# Altium schematic sheet tb-batt-6s.SchDoc
size A
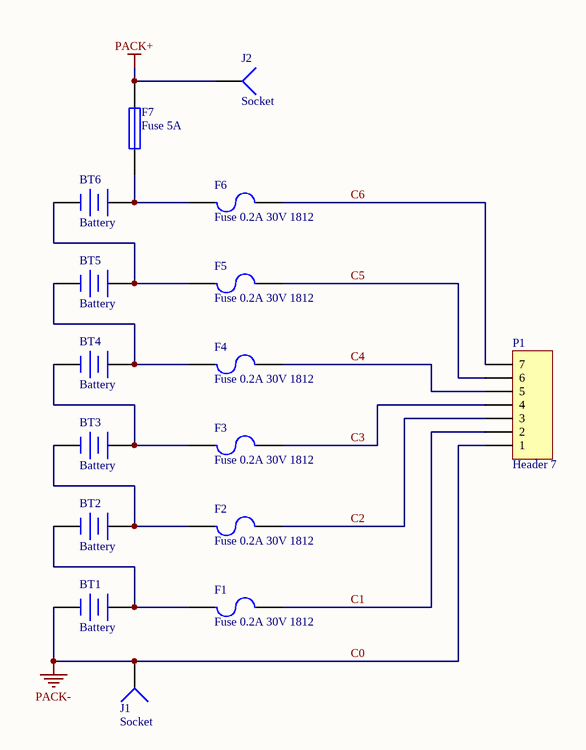
[diagram p0: tb-batt-6s.SchDoc]

## Parts
BT1  Battery  [BAT-2]
BT2  Battery  [BAT-2]
BT3  Battery  [BAT-2]
BT4  Battery  [BAT-2]
BT5  Battery  [BAT-2]
BT6  Battery  [BAT-2]
F1  Fuse 0.2A 30V 1812  [1812]
F2  Fuse 0.2A 30V 1812  [1812]
F3  Fuse 0.2A 30V 1812  [1812]
F4  Fuse 0.2A 30V 1812  [1812]
F5  Fuse 0.2A 30V 1812  [1812]
F6  Fuse 0.2A 30V 1812  [1812]
F7  Fuse 5A  [PIN-W2/E2.8]
J1  Socket  [P+]
J2  Socket  [P+]
P1  Header 7  [HDR1X7]

## Nets
C0: BT1.2(-) J1.1 P1.1  [also labelled PACK-]
PACK+: F7.2 J2.1
C1: F1.2 P1.2
C2: F2.2 P1.3
C3: F3.2 P1.4
C4: F4.2 P1.5
C5: F5.2 P1.6
C6: F6.2 P1.7
NetBT1_1: BT1.1(+) BT2.2(-) F1.1
NetBT2_1: BT2.1(+) BT3.2(-) F2.1
NetBT3_1: BT3.1(+) BT4.2(-) F3.1
NetBT4_1: BT4.1(+) BT5.2(-) F4.1
NetBT5_1: BT5.1(+) BT6.2(-) F5.1
NetBT6_1: BT6.1(+) F6.1 F7.1

## Library data of the parts
BT1-BT6 = Battery: Multicell Battery; Published: 24-Mar-1999; LatestRevisionDate: 17-Jul-2002; LatestRevisionNote: Re-released for DXP Platform.; PackageReference: BAT-2; Publisher: Altium Limited; PackageDescription: Battery; 2 Leads
F1-F6 = Fuse 2: Fuse; Published: 8-Jun-2000; LatestRevisionDate: 17-Jul-2002; LatestRevisionNote: Re-released for DXP Platform.; PackageReference: PIN-W2/E2.8; Publisher: Altium Limited; PackageDescription: Thru-Hole; 2 Leads
F7 = Fuse 1: Fuse; Published: 8-Jun-2000; LatestRevisionDate: 17-Jul-2002; LatestRevisionNote: Re-released for DXP Platform.; PackageReference: PIN-W2/E2.8; Publisher: Altium Limited; PackageDescription: Thru-Hole; 2 Leads
P1 = Header 7: Header, 7-Pin; LatestRevisionDate: 17-Jul-2002; LatestRevisionNote: Re-released for DXP Platform.; Publisher: Altium Limited
J1 J2 = Socket: LatestRevisionDate: 17-Jul-2002; LatestRevisionNote: Re-released for DXP Platform.; Publisher: Altium Limited